# EAGLE design aurola-board (EAGLE 9.1.1)
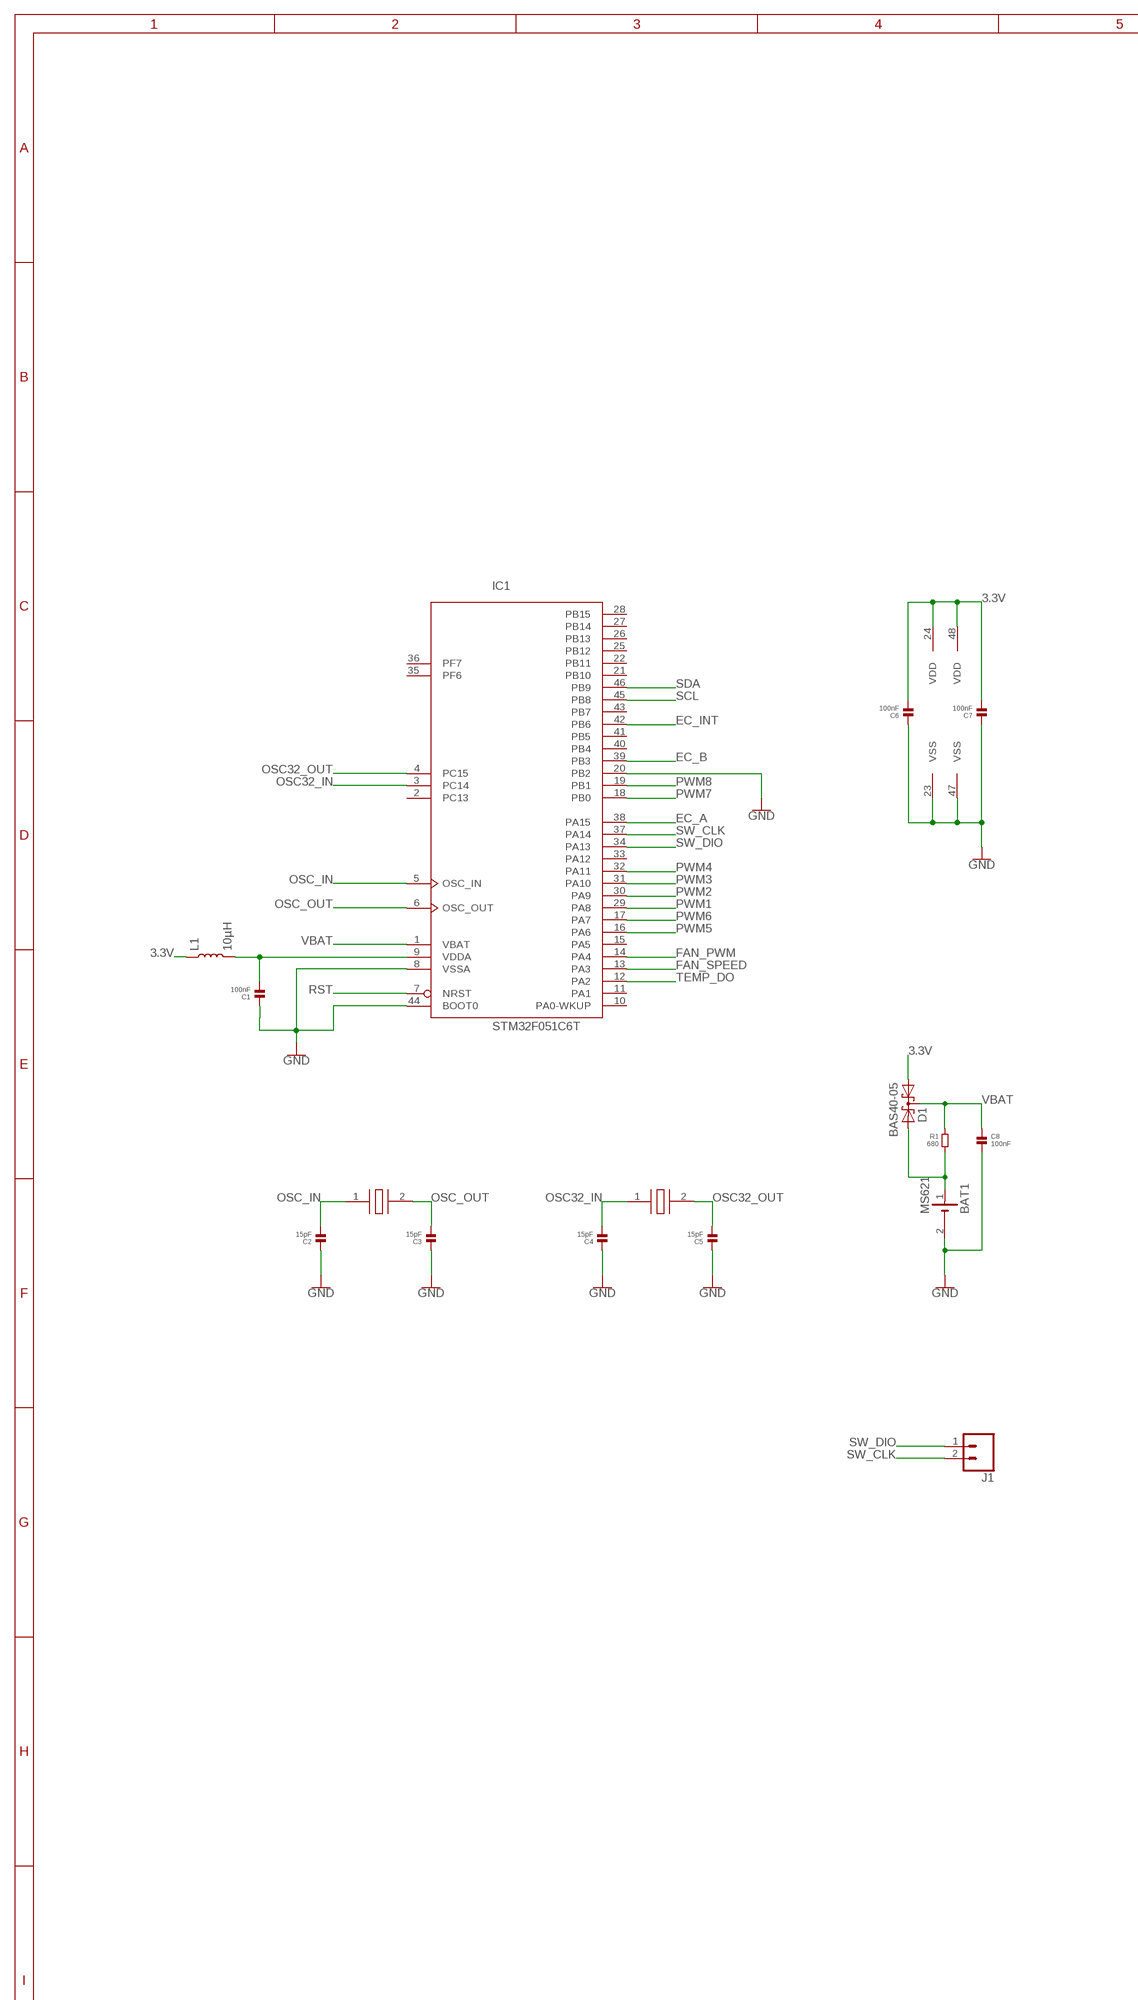
[diagram p0: schematic, sheet 1, part 1 of 2]
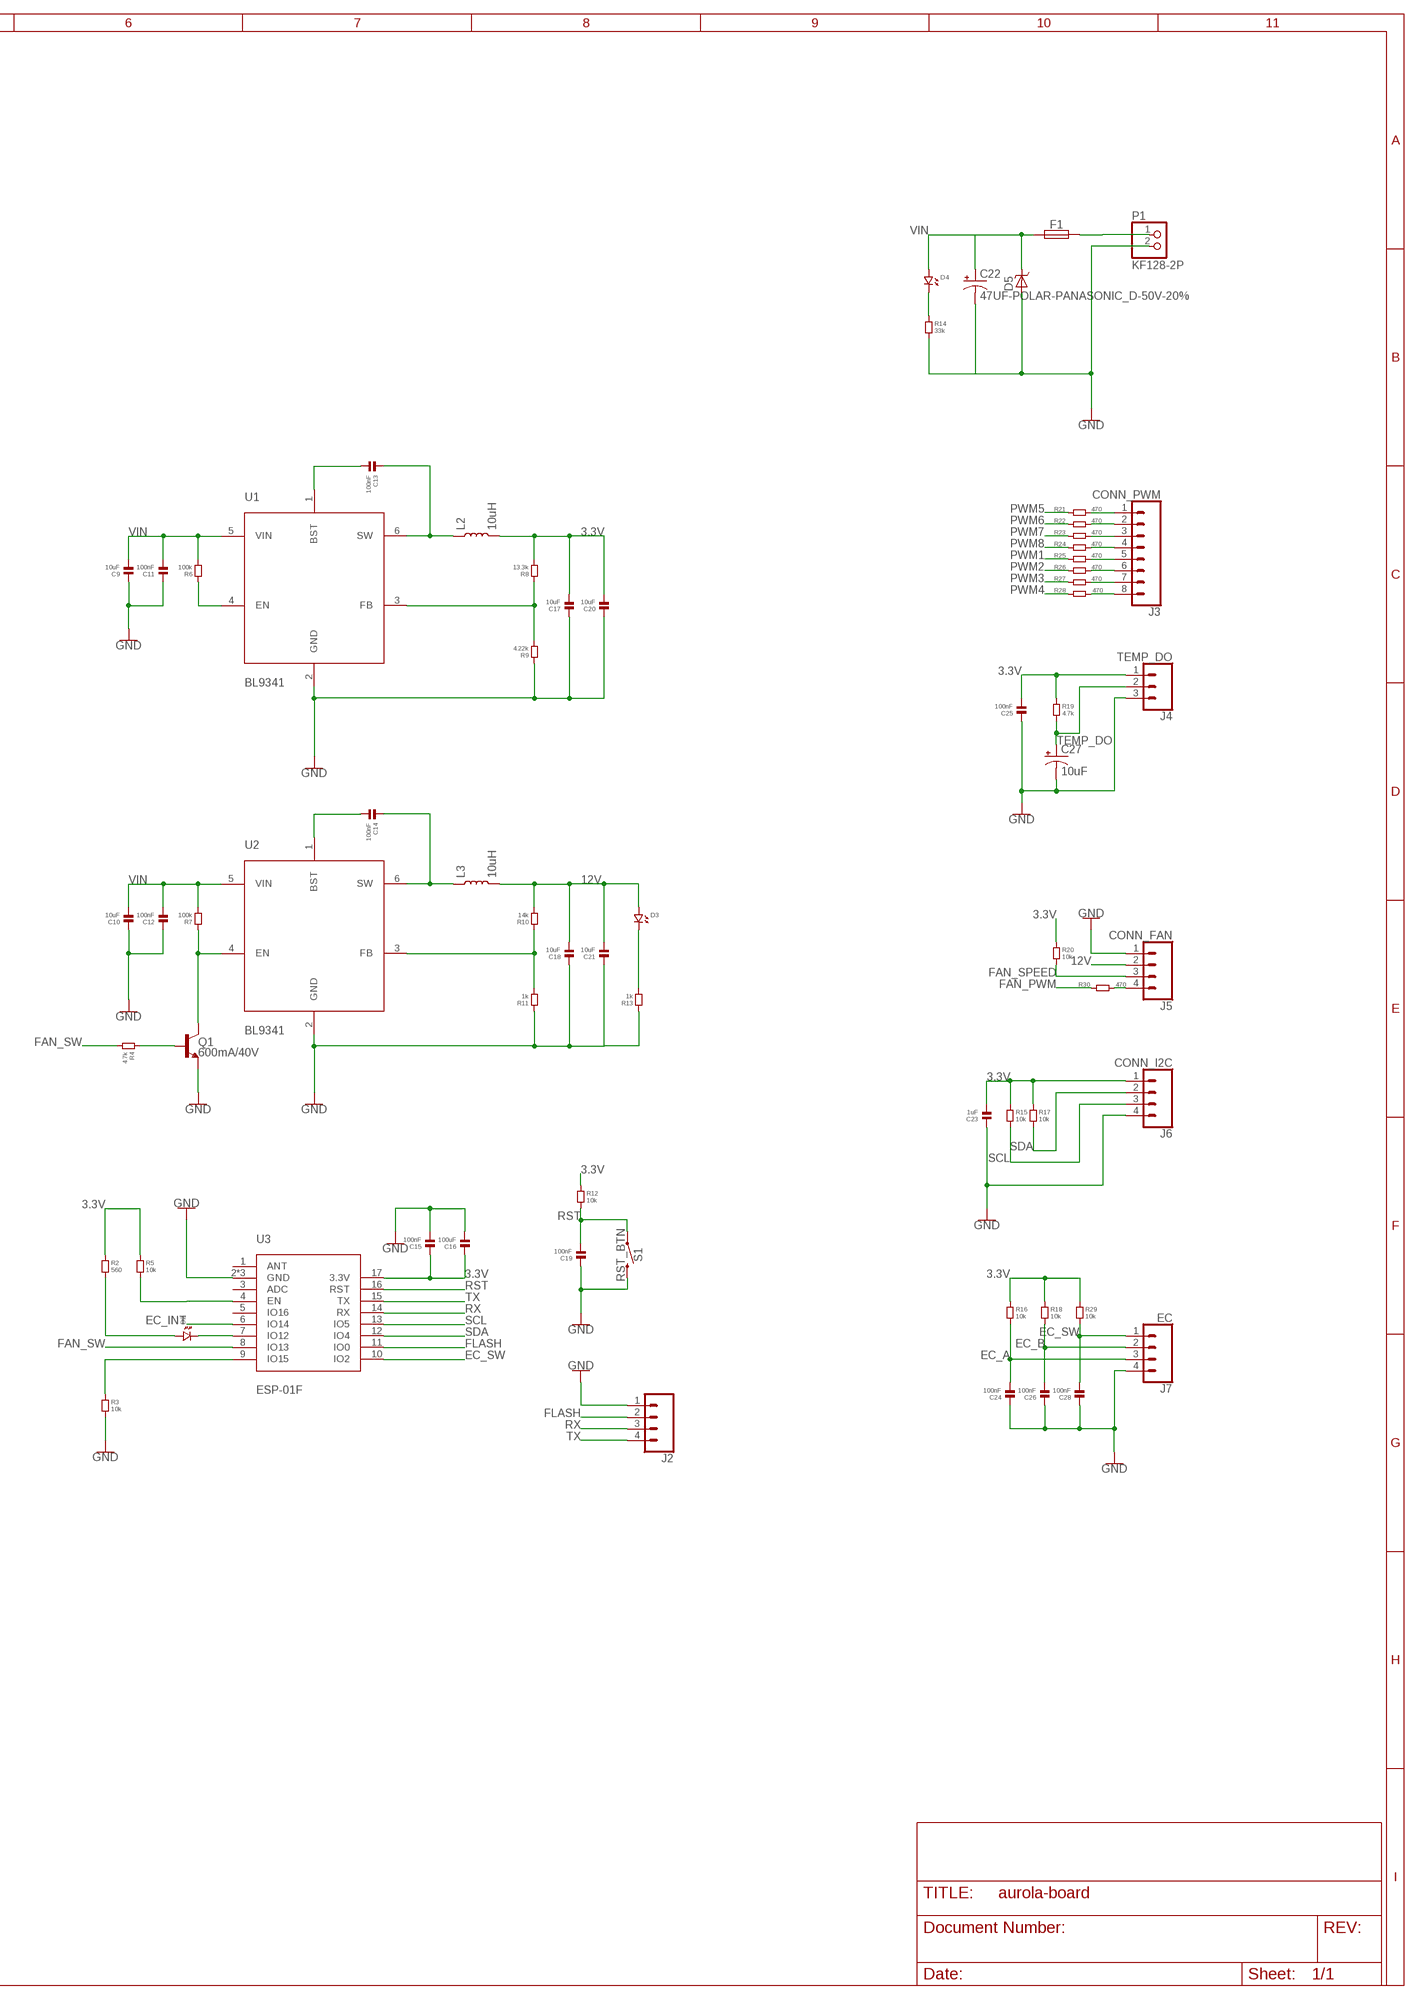
[diagram p1: schematic, sheet 1, part 2 of 2]

## Parts
BAT1  MS621  [SMT_BAT]
C1  100nF  CAPACITOR.0603  [0603]
C2  15pF  CAPACITOR.0603  [0603]
C3  15pF  CAPACITOR.0603  [0603]
C4  15pF  CAPACITOR.0603  [0603]
C5  15pF  CAPACITOR.0603  [0603]
C6  100nF  CAPACITOR.0603  [0603]
C7  100nF  CAPACITOR.0603  [0603]
C8  100nF  CAPACITOR.0603  [0603]
C9  10uF  CAPACITOR.1206  [1206]
C10  10uF  CAPACITOR.1206  [1206]
C11  100nF  CAPACITOR.0805  [0805]
C12  100nF  CAPACITOR.0805  [0805]
C13  100nF  CAPACITOR.0603  [0603]
C14  100nF  CAPACITOR.0603  [0603]
C15  100nF  CAPACITOR.0603  [0603]
C16  100uF  CAPACITOR.1210  [1210]
C17  10uF  CAPACITOR.1206  [1206]
C18  10uF  CAPACITOR.1206  [1206]
C19  100nF  CAPACITOR.0603  [0603]
C20  10uF  CAPACITOR.1206  [1206]
C21  10uF  CAPACITOR.1206  [1206]
C22  47UF-POLAR-PANASONIC_D-50V-20%  [PANASONIC_D]
C23  1uF  CAPACITOR.0603  [0603]
C24  100nF  CAPACITOR.0603  [0603]
C25  100nF  CAPACITOR.0603  [0603]
C26  100nF  CAPACITOR.0603  [0603]
C27  10uF  10UF-POLAR-EIA3216-16V-10%(TANT)  [EIA3216]
C28  100nF  CAPACITOR.0603  [0603]
D1  BAS40-05  [SOT23]
D2  LED.0603  [0603.LED]
D3  LED.0603  [0603.LED]
D4  LED.0603  [0603.LED]
D5  D_TVS-SMA  [SMA_DO214AC]
F1  FUSE-1206  [C1206]
IC1  STM32F051C6T  [LQFP48]
J1  CONN_02  [1X02]
J2  CONN_04  [1X04]
J3  CONN_PWM  PH2.0_8P_SMD  [PH2.0_8P]
J4  TEMP_DO  PH2.0_3P_SMD  [PH2.0_3P]
J5  CONN_FAN  PH2.0_4P_SMD  [PH2.0_4P]
J6  CONN_I2C  PH2.0_4P_SMD  [PH2.0_4P]
J7  EC  PH2.0_4P_SMD  [PH2.0_4P]
L1  10µH  INDUCTOR-0805-3.3UH  [0805]
L2  10uH  INDUCTOR-CR54-47UH  [CR54]
L3  10uH  INDUCTOR-CR54-47UH  [CR54]
P1  KF128-2P  [2P-2.54MM]
Q1  600mA/40V  TRANS_NPN-MMBT2222AL  [SOT23-3]
R1  680  RESISTOR.0805  [0805]
R2  560  RESISTOR.0603  [0603]
R3  10k  RESISTOR.0603  [0603]
R4  4.7k  RESISTOR.0603  [0603]
R5  10k  RESISTOR.0603  [0603]
R6  100k  RESISTOR.0603  [0603]
R7  100k  RESISTOR.0603  [0603]
R8  13.3k  RESISTOR.0603  [0603]
R9  4.22k  RESISTOR.0603  [0603]
R10  14k  RESISTOR.0603  [0603]
R11  1k  RESISTOR.0603  [0603]
R12  10k  RESISTOR.0603  [0603]
R13  1k  RESISTOR.0603  [0603]
R14  33k  RESISTOR.0603  [0603]
R15  10k  RESISTOR.0603  [0603]
R16  10k  RESISTOR.0603  [0603]
R17  10k  RESISTOR.0603  [0603]
R18  10k  RESISTOR.0603  [0603]
R19  4.7k  RESISTOR.0603  [0603]
R20  10k  RESISTOR.0603  [0603]
R21  470  RESISTOR.0603  [0603]
R22  470  RESISTOR.0603  [0603]
R23  470  RESISTOR.0603  [0603]
R24  470  RESISTOR.0603  [0603]
R25  470  RESISTOR.0603  [0603]
R26  470  RESISTOR.0603  [0603]
R27  470  RESISTOR.0603  [0603]
R28  470  RESISTOR.0603  [0603]
R29  10k  RESISTOR.0603  [0603]
R30  470  RESISTOR.0603  [0603]
S1  RST_BTN  MOMENTARY-SWITCH-SPST-SMD-6.0X3.5MM  [TACTILE_SWITCH_SMD_6.0X3.5MM]
U1  BL9341  [SOT23-6]
U2  BL9341  [SOT23-6]
U3  ESP-01F  [ESP-01F]
Y1  NX5032CA-8MHZ  [NX5032CA-8MHZ]
Y2  32.768KHZ-FC-135  [32.768KHZ-FC-135]

## Nets
3.3V: C6.2 C7.2 C15.1 C16.1 C17.2 C20.2 C23.2 C25.2 D1.1(A1) IC1.24(VDD) IC1.48(VDD) J4.1 J6.1 L1.1 L2.P$2 R2.1 R5.1 R8.2 R12.1 R15.1 R16.1 R17.1 R18.1 R19.1 R20.1 R29.1 U3.17(3.3V)
12V: C18.2 C21.2 D3.P$1 J5.2 L3.P$2 R10.2
EC_A: C24.2 IC1.38(PA15) J7.3 R16.2
EC_B: C26.2 IC1.39(PB3) J7.2 R18.2
EC_INT: IC1.42(PB6) U3.6(IO14)
EC_SW: C28.2 J7.1 R29.2 U3.10(IO2)
FAN_PWM: IC1.14(PA4) R30.1
FAN_SPEED: IC1.13(PA3) J5.3 R20.2
FAN_SW: R4.2 U3.8(IO13)
FLASH: J2.2 U3.11(IO0)
GND: BAT1.2(-) C1.1 C2.1 C3.1 C4.1 C5.1 C6.1 C7.1 C8.2 C9.1 C10.1 C11.1 C12.1 C15.2 C16.2 C17.1 C18.1 C19.1 C20.1 C21.1 C22.- C23.1 C24.1 C25.1 C26.1 C27.- C28.1 D5.A IC1.8(VSSA) IC1.20(PB2) IC1.23(VSS) IC1.44(BOOT0) IC1.47(VSS) J2.1 J4.3 J5.1 J6.4 J7.4 P1.2 Q1.2(E) R3.2 R9.1 R11.1 R13.1 R14.2 S1.2 U1.2(GND) U2.2(GND) U3.2(GND) U3.18(GND) U3.19(GND)
N$1: Q1.3(C) R7.1 U2.4(EN)
N$2: C13.1 L2.P$1 U1.6(SW)
N$3: R6.1 U1.4(EN)
N$4: R8.1 R9.2 U1.3(FB)
N$5: R10.1 R11.2 U2.3(FB)
N$6: C14.1 L3.P$1 U2.6(SW)
N$7: C14.2 U2.1(BST)
N$8: C13.2 U1.1(BST)
N$9: J3.1 R21.2
N$10: J3.2 R22.2
N$11: J3.3 R23.2
N$12: J3.4 R24.2
N$13: J3.5 R25.2
N$14: J3.6 R26.2
N$15: J3.7 R27.2
N$16: J3.8 R28.2
N$17: R5.2 U3.4(EN)
N$18: J5.4 R30.2
N$19: R3.1 U3.9(IO15)
N$20: Q1.1(B) R4.1
N$21: BAT1.1(+) D1.2(A2) R1.2
N$22: C1.2 IC1.9(VDDA) L1.2
N$23: D2.P$2 U3.7(IO12)
N$24: D2.P$1 R2.2
N$25: F1.2 P1.1
N$27: D4.P$2 R14.1
N$28: D3.P$2 R13.2
OSC32_IN: C4.2 IC1.3(PC14) Y2.1(1.XIN)
OSC32_OUT: C5.2 IC1.4(PC15) Y2.2(2.XIN)
OSC_IN: C2.2 IC1.5(OSC_IN) Y1.1(1.XIN)
OSC_OUT: C3.2 IC1.6(OSC_OUT) Y1.2(2.XOUT)
PWM1: IC1.29(PA8) R25.1
PWM2: IC1.30(PA9) R26.1
PWM3: IC1.31(PA10) R27.1
PWM4: IC1.32(PA11) R28.1
PWM5: IC1.16(PA6) R21.1
PWM6: IC1.17(PA7) R22.1
PWM7: IC1.18(PB0) R23.1
PWM8: IC1.19(PB1) R24.1
RST: C19.2 IC1.7(NRST) R12.2 S1.1 U3.16(RST)
RX: J2.3 U3.14(RX)
SCL: IC1.45(PB8) J6.3 R15.2 U3.13(IO5)
SDA: IC1.46(PB9) J6.2 R17.2 U3.12(IO4)
SW_CLK: IC1.37(PA14) J1.2
SW_DIO: IC1.34(PA13) J1.1
TEMP_DO: C27.+ IC1.12(PA2) J4.2 R19.2
TX: J2.4 U3.15(TX)
VBAT: C8.1 D1.3(K1K2) IC1.1(VBAT) R1.1
VIN: C9.2 C10.2 C11.2 C12.2 C22.+ D4.P$1 D5.C F1.1 R6.2 R7.2 U1.5(VIN) U2.5(VIN)
Unconnected: IC1.2(PC13) IC1.10(PA0-WKUP) IC1.11(PA1) IC1.15(PA5) IC1.21(PB10) IC1.22(PB11) IC1.25(PB12) IC1.26(PB13) IC1.27(PB14) IC1.28(PB15) IC1.33(PA12) IC1.35(PF6) IC1.36(PF7) IC1.40(PB4) IC1.41(PB5) IC1.43(PB7) U3.1(ANT) U3.3(ADC) U3.5(IO16)

## Library data of the parts
BAT1 = chip:MS621
C1-C21 C23-C26 C28 = standardparts:CAPACITOR
C22 = SparkFun-Capacitors:47UF-POLAR: 47µF polarized capacitors A capacitor is a passive two-terminal electrical component used to store electrical energy temporarily in an electric field.
C27 = SparkFun-Capacitors:10UF-POLAR: 10.0µF polarized capacitors A capacitor is a passive two-terminal electrical component used to store electrical energy temporarily in an electric field.; PROD_ID: CAP-00811
D1 = nxp_60:BAS40-05: General-purpose Schottky diodes General-purpose Schottky diodes in small Surface-Mounted Device (SMD) plastic packages AAL Eindhoven MK
D2-D4 = standardparts:LED
D5 = we-rcl:D_TVS: TVS Diodes (Transient Voltage Suppressor Diodes)
F1 = we-rcl:FUSE: Fuses Polyfuses 0805 - 0.5A or 1A, 6V 1206 - 2A, 6V 1812 - 1A or 2A, 16V
IC1 = micro-stm_v2:STM32F051C*T: ARM 32-bit Cortex™-M0 CPU 48 MHz maximum frequency 16 to 64 Kbytes of Flash memory 4 to 8 kbytes of SRAM 39 GPIOs 2.0 to 3.6 V application supply
J1 = SparkFun-Connectors:CONN_02: Multi connection point. Often used as Generic Header-pin footprint for 0.1 inch spaced/style header connections On any of the 0.1 inch spaced packages, you can populate with these: Break Away Headers - Straight <https://www.sparkfun.com/products/116> (PRT-00116) Break Away Male Headers - Right Angle <https://www.sparkfun.com/products/553> (PRT-00553) Female Headers <https://www.sparkfun.com/products/115> (PRT-00115) Break Away Headers - Machine Pin <https://www.sparkfun.com/products/117> (PRT-00117) Break Away Female Headers - Swiss Machine Pin <https://www.sparkfun.com/products/743> (PRT-00743) For SCREWTERMINALS and SPRING TERMINALS visit here: Screw Terimnals on SparkFun.com <https://www.sparkfun.com/search/results?term=Screw+Terminals> (5mm/3.5mm/2.54mm spacing) This device is also useful as a general connection point to wire up your design to another part of your project. Our various solder wires solder well into these plated through hole pads. Hook-Up Wire - Assortment (Stranded, 22 AWG) <https://www.sparkfun.com/products/11375> (PRT-11375) Hook-Up Wire - Assortment (Solid Core, 22 AWG) <https://www.sparkfun.com/products/11367> (PRT-11367) View the entire wire category on our website here <https://www.sparkfun.com/categories/141> Special notes: Molex polarized connector foot print use with: PRT-08233 with associated crimp pins and housings. 2.54_SCREWTERM for use with PRT-10571. 3.5mm Screw Terminal footprints for PRT-08084 5mm Screw Terminal footprints for use with PRT-08432
J2 = SparkFun-Connectors:CONN_04: Multi connection point. Often used as Generic Header-pin footprint for 0.1 inch spaced/style header connections On any of the 0.1 inch spaced packages, you can populate with these: Break Away Headers - Straight <https://www.sparkfun.com/products/116> (PRT-00116) Break Away Male Headers - Right Angle <https://www.sparkfun.com/products/553> (PRT-00553) Female Headers <https://www.sparkfun.com/products/115> (PRT-00115) Break Away Headers - Machine Pin <https://www.sparkfun.com/products/117> (PRT-00117) Break Away Female Headers - Swiss Machine Pin <https://www.sparkfun.com/products/743> (PRT-00743) For SCREWTERMINALS and SPRING TERMINALS visit here: Screw Terimnals on SparkFun.com <https://www.sparkfun.com/search/results?term=Screw+Terminals> (5mm/3.5mm/2.54mm spacing) This device is also useful as a general connection point to wire up your design to another part of your project. Our various solder wires solder well into these plated through hole pads. Hook-Up Wire - Assortment (Stranded, 22 AWG) <https://www.sparkfun.com/products/11375> (PRT-11375) Hook-Up Wire - Assortment (Solid Core, 22 AWG) <https://www.sparkfun.com/products/11367> (PRT-11367) View the entire wire category on our website here <https://www.sparkfun.com/categories/141> Special notes: Molex polarized connector foot print use with SKU : PRT-08231 with associated crimp pins and housings. 1MM SMD Version SKU: PRT-10208; PROD_ID: CONN-09696
J3 = conn_smt:PH2.0_8P_SMD: PH2.0_8P_SMD
J4 = conn_smt:PH2.0_3P_SMD: PH2.0_3P
J5-J7 = conn_smt:PH2.0_4P_SMD: PH2.0_4P_SMD
L1 = SparkFun-Coils:INDUCTOR: Inductors Resist changes in electrical current. Basically a coil of wire. SparkFun Products: SparkFun Load Cell Amplifier - HX711 <https://www.sparkfun.com/products/13879> IOIO-OTG - V2.2 <https://www.sparkfun.com/products/13613>; PROD_ID: NDUC-13076; VALUE: 3.3µH/±20%/450mA
L2 L3 = SparkFun-Coils:INDUCTOR: Inductors Resist changes in electrical current. Basically a coil of wire. SparkFun Products: SparkFun Load Cell Amplifier - HX711 <https://www.sparkfun.com/products/13879> IOIO-OTG - V2.2 <https://www.sparkfun.com/products/13613>; PROD_ID: NDUC-10789; VALUE: 47µH/±30%/750mA
P1 = chip:KF128-2P
Q1 = SparkFun-DiscreteSemi:TRANS_NPN: NPN transistor Current controlled devices typically used to amplify current or used as a switch. BC547 - COM-08928 <http://www.sparkfun.com/products/8928> (TO-92 45V 100mA) (1.Collector 2.Base 3.Emitter) 2N3904 - COM-00521 <http://www.sparkfun.com/products/521> (TO-92 40V 200mA) (1.Emitter 2.Base 3.Collector) P2N2222A - COM-12852 <http://www.sparkfun.com/products/12852> (TO-92 40V 600mA) (1.Collector 2.Base 3.Emitter); PROD_ID: TRANS-08049
R1-R30 = standardparts:RESISTOR
S1 = SparkFun-Switches:MOMENTARY-SWITCH-SPST: Momentary Switch (Pushbutton) - SPST Normally-open (NO) SPST momentary switches (buttons, pushbuttons). Variants PTH-12MM - 12mm square, through-hole Momentary Pushbutton Switch - 12mm Square <https://www.sparkfun.com/products/9190> (COM-09190) PTH-6.0MM, PTH-6.0MM-KIT - 6.0mm square, through-hole Mini Pushbutton Switch <https://www.sparkfun.com/products/97> (COM-00097) KIT package intended for soldering kit's - only one side of pads' copper is exposed. PTH-RIGHT-ANGLE-KIT - Right-angle, through-hole Right Angle Tactile Button <https://www.sparkfun.com/products/10791> - Used on SparkFun BigTime Watch Kit <https://www.sparkfun.com/products/11734> SMD-12MM - 12mm square, surface-mount Tactile Button - SMD (12mm) <https://www.sparkfun.com/products/12993> (COM-12993) Used on SparkFun PicoBoard <https://www.sparkfun.com/products/11888> SMD-4.5MM - 4.5mm Square Trackball Switch Used on SparkFun Blackberry Trackballer Breakout <https://www.sparkfun.com/products/13169> SMD-4.6MMX2.8MM - 4.60mm x 2.80mm, surface mount Used on SparkFun SAMD21 Mini Breakout <https://www.sparkfun.com/products/13664> SMD-5.2MM, SMD-5.2-REDUNDANT - 5.2mm square, surface-mount Mini Pushbutton Switch - SMD <https://www.sparkfun.com/products/8720> (COM-08720) Used on Arduino Pro Mini <https://www.sparkfun.com/products/11114> REDUNDANT package connects both switch circuits together SMD-6.0X3.5MM - 6.0 x 3.5mm, surface mount Momentary Reset Switch SMD <https://www.sparkfun.com/products/8229> (COM-08229) SMD-6.2MM-TALL - 6.2mm square, surface mount Tactile Button - SMD (6mm) <https://www.sparkfun.com/products/12992> Used on SparkFun Digital Sandbox <https://www.sparkfun.com/products/12651> SMD-RIGHT-ANGLE - Right-angle, surface mount Used on SparkFun Block for Intel® Edison - Arduino <https://www.sparkfun.com/products/13036>; PROD_ID: SWCH-00815; SF_SKU: COM-08229
U1 U2 = dcdc:BL9341: BL9341
U3 = esp_mod:ESP-01F: ESP-01F
Y1 = NX5032CA-8MHZ:NX5032CA-8MHZ
Y2 = 32.768KHZ-FC-135:32.768KHZ-FC-135

## Net classes
0 default: width 0.254 mm, drill 0.3 mm

## Board
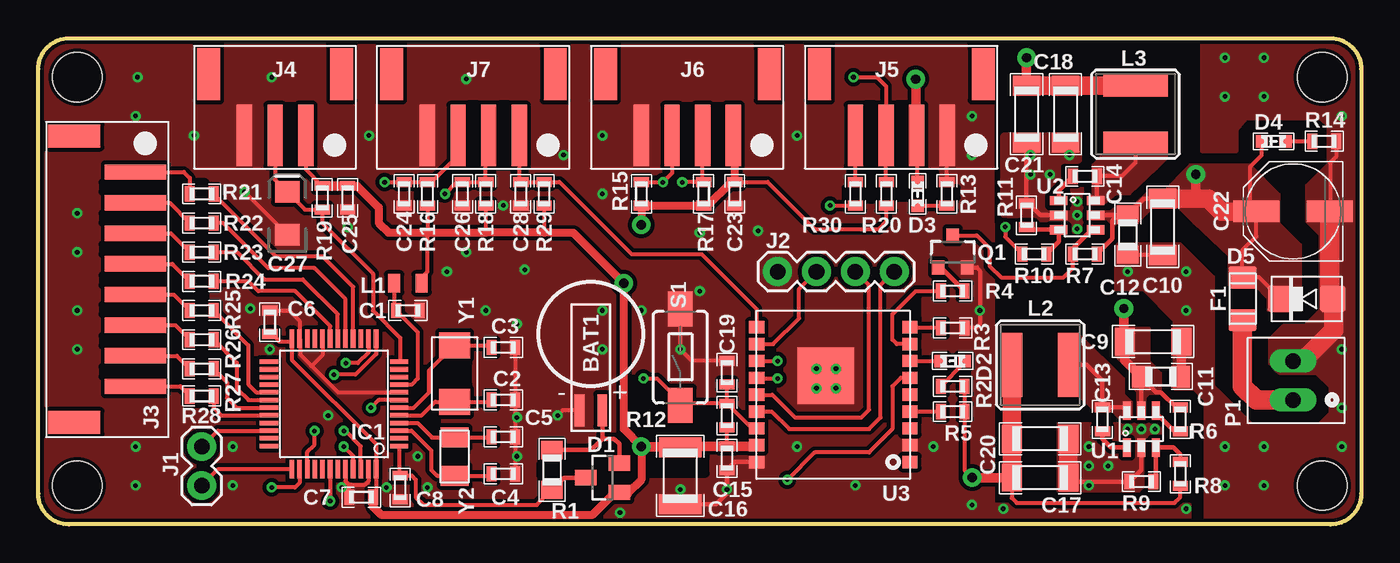
[diagram p2: board, top side]
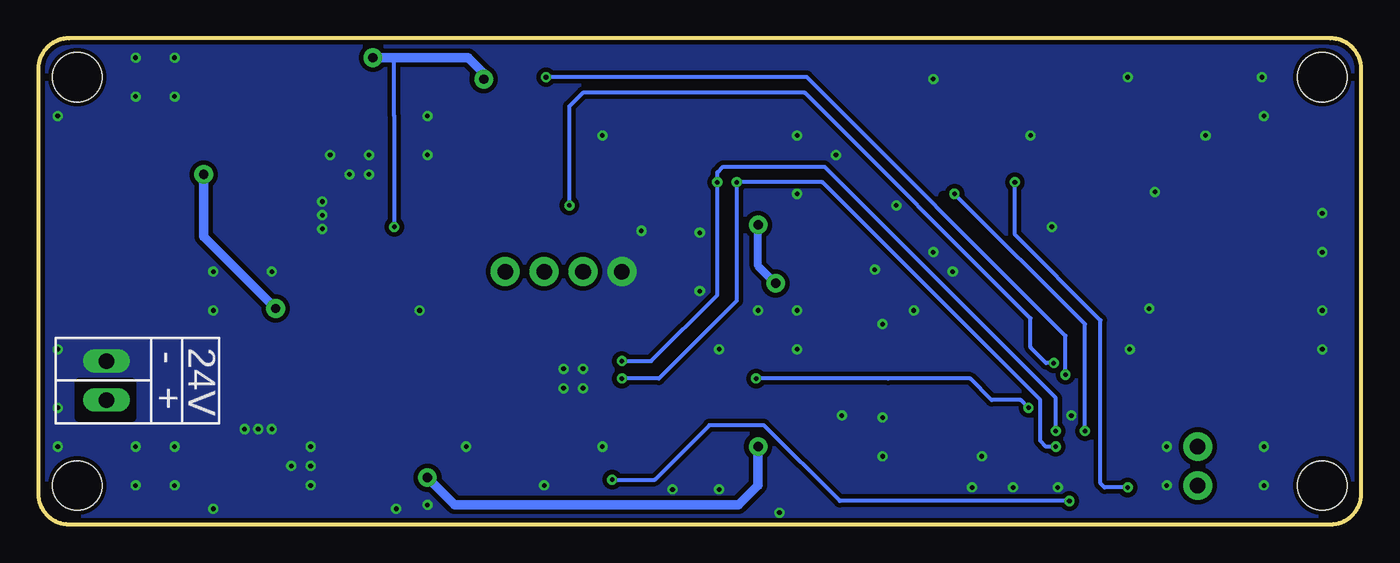
[diagram p3: board, bottom side, seen from below]

Size 86.36 x 31.75 mm. Coordinates in mm from the lower left corner, seen from the top.
Outline: 0,2 0,29.75 arc-90 2,31.75 84.36,31.75 arc-90 86.36,29.75 86.36,2 arc-90 84.36,0 2,0 arc-90 0,2
Copper layers (1*16): Top 0.035mm / dielectric 1.5mm / Bottom 0.035mm
Design rules "SparkFun-2-layer-TIGHT *": minimum track width 7mil, minimum drill 0.3mm, track to track 7mil, track to pad 7mil, pad to pad 7mil, via to via 7mil, smd to smd 0mil, copper to edge 7mil, drill to drill 7mil, minimum pad ring 7mil, minimum via ring 7mil, stop-mask expansion 4mil, vias tented up to drill 25mil, thermal gap 10mil
Holes 3.2 mm at 83.82,29.21 83.82,2.54 2.54,29.21 2.54,2.54
tRestrict: area 10.4,7.9 to 10.9,22.4; area 4.2,21.7 to 8.4,22.4; area 4.2,19.7 to 8.4,20.3; area 4.2,17.7 to 8.4,18.3; area 4.2,15.6 to 8.4,16.3; area 4.2,13.7 to 8.4,14.4; area 4.2,11.7 to 8.4,12.3; area 4.2,9.7 to 8.4,10.3; area 38.9,21.3 to 40.4,21.8; area 40,3.3 to 43.6,4.3; area 16.1,26 to 16.8,27.3; area 28.1,26.2 to 28.7,27.4; 18 more areas
bRestrict: area 26.9,21 to 27.3,21.5; area 80.4,9 to 83.7,9.3; area 80.4,7 to 83.7,7.2; area 83.6,7.4 to 83.7,8.9; area 80.3,7 to 80.4,9.3

### Footprints (pad centres in the part's own frame; a part is rotated, then mirrored left to right if it is on the bottom)
SMT_BAT = smd 2.1 x 0.65: 1 5,0.75; 2 5,-0.75
0603 = smd 0.65 x 1: 1 -0.775,0; 2 0.775,0
1206 = smd 1.3 x 1.8: 1 -1.85,0; 2 1.85,0
0805 = smd 1.2 x 1.4: 1 -1.3,0; 2 1.3,0
1210 = smd 1.3 x 2.8: 1 -1.85,0; 2 1.85,0
PANASONIC_D = smd 3 x 1.4: + 2.4,0; - -2.4,0
EIA3216 = smd 1.4 x 1.6: + 1.4,0; - -1.4,0
SOT23 = smd 1 x 1.4: 1 -0.95,-1.1; 2 0.95,-1.1; 3 0,1.1
0603.LED = smd 0.8 x 0.8: P$1 -0.775,0; P$2 0.775,0
SMA_DO214AC = smd 1.7 x 1.7: A 0,-1.7; C 0,1.7
C1206 = smd 1.8 x 1.45: 1 0,1.4; 2 0,-1.4
LQFP48 = smd 0.3 x 1.2: 1 -2.75,-4.25; 2 -2.25,-4.25; 3 -1.75,-4.25; 4 -1.25,-4.25; 5 -0.75,-4.25; 6 -0.25,-4.25; 7 0.25,-4.25; 8 0.75,-4.25; 9 1.25,-4.25; 10 1.75,-4.25; 11 2.25,-4.25; 12 2.75,-4.25; 25 2.75,4.25; 26 2.25,4.25; 27 1.75,4.25; 28 1.25,4.25; 29 0.75,4.25; 30 0.25,4.25; 31 -0.25,4.25; 32 -0.75,4.25; 33 -1.25,4.25; 34 -1.75,4.25; 35 -2.25,4.25; 36 -2.75,4.25 | smd 1.2 x 0.3: 13 4.25,-2.75; 14 4.25,-2.25; 15 4.25,-1.75; 16 4.25,-1.25; 17 4.25,-0.75; 18 4.25,-0.25; 19 4.25,0.25; 20 4.25,0.75; 21 4.25,1.25; 22 4.25,1.75; 23 4.25,2.25; 24 4.25,2.75; 37 -4.25,2.75; 38 -4.25,2.25; 39 -4.25,1.75; 40 -4.25,1.25; 41 -4.25,0.75; 42 -4.25,0.25; 43 -4.25,-0.25; 44 -4.25,-0.75; 45 -4.25,-1.25; 46 -4.25,-1.75; 47 -4.25,-2.25; 48 -4.25,-2.75
1X02 = drill 1.016 pad 1.88: 1 0,0; 2 2.54,0
1X04 = drill 1.016 pad 1.88: 1 0,0; 2 2.54,0; 3 5.08,0; 4 7.62,0
PH2.0_8P = smd 1 x 4: 1 14,0; 2 12,0; 3 10,0; 4 8,0; 5 6,0; 6 4,0; 7 2,0; 8 0,0 | smd 1.5 x 3.4: TL -2.35,4; TR 16.35,4
PH2.0_3P = smd 1 x 4: 1 4,0; 2 2,0; 3 0,0 | smd 1.5 x 3.4: TL -2.35,4; TR 6.35,4
PH2.0_4P = smd 1 x 4: 1 6,0; 2 4,0; 3 2,0; 4 0,0 | smd 1.5 x 3.4: TL -2.35,4; TR 8.35,4
0805' = smd 0.8 x 1.2: 1 -0.9,0; 2 0.9,0
CR54 = smd 4.2 x 1.4: P$1 0,1.85; P$2 0,-1.85
2P-2.54MM = drill 1.016 long: 1 1.27,0; 2 -1.27,0
SOT23-3 = smd 0.8 x 0.9: 1 -0.95,-1; 2 0.95,-1; 3 0,1.1
TACTILE_SWITCH_SMD_6.0X3.5MM = smd 2.3 x 1.6: 1 -3.15,0; 2 3.15,0
SOT23-6 = smd 1.2 x 0.6: 1 -1.2,0.95; 2 -1.2,0; 3 -1.2,-0.95; 4 1.2,-0.95; 5 1.2,0; 6 1.2,0.95
ESP-01F = smd 1 x 0.8: 1 0,9.9; 2 0,8.8; 3 0,7.7; 4 0,6.6; 5 0,5.5; 6 0,4.4; 7 0,3.3; 8 0,2.2; 9 0,1.1; 10 10,1.1; 11 10,2.2; 12 10,3.3; 13 10,4.4; 14 10,5.5; 15 10,6.6; 16 10,7.7; 17 10,8.8; 18 10,9.9 | smd 3.7 x 3.7: 19 5.5,4.25
NX5032CA-8MHZ = smd 1.7 x 2: 1 0,0; 2 3.7,0
32.768KHZ-FC-135 = smd 1.3 x 1.8: 1 0,0; 2 2.5,0

### Placement (x,y rotation side)
BAT1  36.07,12.45 270 top
C1  24.13,13.97 180 top
C2  30.35,8.13 180 top
C3  30.35,11.56 180 top
C4  30.35,3.3 180 top
C5  30.35,5.71 180 top
C6  15.11,13.21 270 top
C7  21.08,1.78 0 top
C8  23.62,2.41 270 top
C9  72.77,11.94 180 top
C10  73.41,19.43 90 top
C11  73.28,9.65 180 top
C12  71.12,18.92 90 top
C13  69.47,6.86 270 top
C14  68.33,22.73 180 top
C15  44.96,4.32 270 top
C16  41.91,3.17 270 top
C17  65.41,3.05 180 top
C18  67.06,26.8 90 top
C19  44.96,9.91 270 top
C20  65.41,5.59 180 top
C21  64.52,26.8 90 top
C22  81.92,20.45 180 top
C23  45.47,21.59 90 top
C24  23.88,21.59 90 top
C25  20.19,21.34 90 top
C26  27.69,21.59 90 top
C27  16.26,20.32 90 top
C28  31.5,21.59 90 top
D1  36.83,3.05 90 top
D2  59.69,10.67 180 top
D3  57.4,21.59 270 top
D4  80.64,25.02 0 top
D5  82.8,14.73 90 top
F1  78.61,14.73 0 top
IC1  19.3,7.87 90 top
J1  10.67,5.08 270 top
J2  48.26,16.51 0 top
J3  6.35,9.01 90 top
J4  13.46,25.4 0 top
J5  53.34,25.4 0 top
J6  39.37,25.4 0 top
J7  25.4,25.4 0 top
L1  10µH  [0805']  24.13,15.75 180 top
L2  65.41,10.41 270 top
L3  71.63,26.8 180 top
P1  81.92,9.4 270 top
Q1  59.69,17.78 0 top
R1  33.53,3.56 90 top
R2  59.69,9.02 180 top
R3  59.69,12.83 0 top
R4  59.69,15.24 180 top
R5  59.69,7.37 180 top
R6  74.55,6.86 90 top
R7  68.33,17.65 0 top
R8  74.55,3.3 270 top
R9  72.01,2.79 0 top
R10  65.02,17.65 180 top
R11  64.52,20.19 270 top
R12  44.96,7.11 90 top
R13  59.31,21.59 270 top
R14  83.95,25.02 0 top
R15  39.37,21.59 90 top
R16  25.4,21.59 90 top
R17  43.43,21.59 90 top
R18  29.21,21.59 90 top
R19  18.54,21.34 270 top
R20  55.37,21.59 90 top
R21  10.67,21.59 180 top
R22  10.67,19.68 180 top
R23  10.67,17.78 180 top
R24  10.67,15.88 180 top
R25  10.67,13.97 180 top
R26  10.67,12.06 180 top
R27  10.67,10.16 180 top
R28  10.67,8.38 180 top
R29  33.02,21.59 90 top
R30  53.34,21.59 90 top
S1  41.91,10.92 90 top
U1  72.01,6.22 90 top
U2  67.82,20.19 0 top
U3  56.9,13.97 180 top
Y1  27.18,8 90 top
Y2  27.18,3.17 90 top

### Tracks (layer width: path | path; a pad name or v marks a point on that pad's centre or on a via)
3.3V  (via drill 0.61 pad 1.22)
  Top 0.254: C17.2 63.55,1.72 63.88,1.4 74.17,1.4 74.55,1.78 R8.2 | C15.1 R12.1 | R2.1 R5.1 60.47,3.54 v60.96,3.05 | 41.85,5.08 C16.1 | C7.2 22.05,1.98 IC1.48 22.05,5.25 16.55,10.75 16.55,11.94 | IC1.24 16.55,11.94 | C6.2 15.25,12.43 15.75,11.94 16.55,11.94 | 45.24,22.36 C23.2 47.61,22.36 50.67,19.3 54.86,19.3 55.37,19.81 R20.1 | 45.47,25.3 J6.1 | R17.1 43.69,20.82 | R16.1 25.4,19.05 25.4,16.51 25.03,16.14 L1.1 | R18.1 29.21,19.05 | 33.53,19.04 33.52,19.05 | R29.1 33.02,19.05 | J4.1 17.46,23.19 R19.1
  Top 0.457: 37.66,2.1 D1.1
  Top 0.508: 38.48,2.03 39.37,2.92 v39.37,5.08 38.23,6.22 v38.23,15.75 34.94,19.04 33.53,19.04 | 37.66,2.1 36.2,0.64 22.36,0.64 21.86,1.14 C7.2 | 43.69,20.82 45.24,22.36 | C23.2 45.47,25.3 | C25.2 20.82,22.11 22.23,20.7 22.23,19.68 22.86,19.05 25.4,19.05 29.21,19.05 33.02,19.05 33.52,19.05 | R17.1 R15.1 v39.37,19.56
  Top 0.61: C16.1 41.98,5.09 C15.1 46.82,5.09 U3.17 | v60.96,3.05 C17.2 | v39.37,5.08 41.85,5.08 | 38.48,2.03 38.41,2.1 D1.1 | R19.1 C25.2
  Top 1.219: L2.P$2 C20.2 C17.2
  Bottom 0.508: v38.23,15.75 39.37,16.89 v39.37,19.56
  Bottom 0.61: v60.96,3.05 59.18,1.27 40.64,1.27 39.37,2.54 v39.37,5.08
12V  (via drill 0.3, 0.61 pad 1.22)
  Top 0.254: J5.2 57.28,25.46 57.4,25.34 D3.P$1 | v63.12,19.43 63.12,18.78 R10.2
  Top 0.61: C21.2 v64.52,30.48 | v57.28,29.08 57.28,25.46
  Top 1.219: C21.2 C18.2 L3.P$2
  Bottom 0.254: v63.12,19.43 63.12,26.67 63.12,30.48
  Bottom 0.61: v64.52,30.48 63.12,30.48 58.29,30.48 57.28,29.46 v57.28,29.08
EC_A  (via drill 0.3)
  Top 0.254: J7.3 27.4,24.16 27.43,24.13 25.67,22.36 R16.2 C24.2 22.62,22.36 v22.61,22.35 | IC1.38 17.05,2.7 16.76,2.41 v15.24,2.41
  Bottom 0.254: v22.61,22.35 22.61,18.92 17.02,13.34 17.02,2.67 16.76,2.41 v15.24,2.41
EC_B  (via drill 0.3)
  Top 0.254: J7.2 29.21,25.21 R18.2 C26.2 27.32,22.36 v26.54,21.59 | IC1.39 17.55,4.73 18.03,5.21 v18.03,6.1
  Bottom 0.254: v18.03,6.1 18.03,13.08 v26.54,21.59
EC_INT  (via drill 0.3)
  Top 0.254: U3.6 56.31,9.57 55.75,9.02 55.75,6.22 54.23,4.7 50.67,4.7 v48.9,2.92 | IC1.42 v19.05,1.53 v19.05,1.52
  Bottom 0.254: v19.05,1.52 34.04,1.52 38.99,6.48 42.55,6.48 46.1,2.92 v48.9,2.92
EC_SW
  Top 0.254: J7.1 31.4,22.46 C28.2 R29.2 34.02,22.36 38.73,17.65 43.31,17.65 46.9,14.06 U3.10
FAN_PWM  (via drill 0.3)
  Top 0.254: v51.69,20.83 51.7,20.82 R30.1 | IC1.14 21.55,11.24 20.85,10.54 v20.07,10.54
  Bottom 0.254: v20.07,10.54 20.57,10.54 21.59,11.56 21.59,13.46 36.32,28.19 50.8,28.19 51.69,27.3 v51.69,20.83
FAN_SPEED  (via drill 0.3)
  Top 0.254: R20.2 55.34,22.4 J5.3 55.34,28.61 54.74,29.21 v53.21,29.21 | IC1.13 22.05,11.13 20.7,9.78 v19.3,9.78
  Bottom 0.254: v53.21,29.21 36.2,29.21 19.3,12.32 v19.3,9.78
FAN_SW
  Top 0.254: U3.8 56.05,11.77 55.75,12.06 55.75,13.72 57.28,15.24 R4.2
FLASH
  Top 0.254: U3.11 47.97,11.77 49.66,13.46 49.66,15.37 J2.2
GND  (via drill 0.3)
  Top 0.254: R11.1 64.63,20.97 | C12.1 73.36,17.62 C10.1 | R14.2 84.72,24.02 84.33,23.62 C22.- | 84.31,14.92 D5.A 84.58,14.65 | 74.62,9.69 C11.1 | C17.1 67.51,2.79 | R13.1 59.31,25.37 J5.1 | R3.2 61.21,12.83 61.47,13.08 v61.47,13.97 61.47,16.59 61.27,16.78 Q1.2 | C3.1 C2.1 C5.1 C4.1 | BAT1.2 34.24,7.45 v33.91,7.11 | v13.46,21.72 v13.46,21.71 C27.- | C6.1 16.37,13.98 17.05,13.3 IC1.23 17.1,12.08 17.1,11.09 17.84,10.35 | C19.1 42.66,10.68 v41.91,11.43 S1.2 | 17.84,10.35 19.56,8.62 IC1.8 | IC1.20 18.55,11.06 17.84,10.35 | IC1.47 21.55,2.82 21.33,2.59 20.43,2.59 20.41,2.59 | IC1.44 20.05,2.82 20.34,2.53 20.41,2.59 | C7.1 20.31,2.59 20.41,2.59
  Top 0.305: 64.63,20.97 65.41,20.19 U2.2 | R11.1 C21.1 | U1.2 72.01,3.57 R9.1 67.51,2.79 | C16.2 44.25,1.32 44.96,2.03 v44.96,2.29 C15.2 45.48,4.07 U3.18
  Top 0.61: C9.1 74.62,9.69
  Top 1.219: C20.1 C17.1
  Top 1.27: C22.- 84.31,14.92 | P1.2 82.55,10.67 84.58,12.7 84.58,14.65
  other vias: 67.82,21.08 67.82,20.19 67.82,19.3 71.12,6.22 72.01,6.22 72.9,6.22 13.84,14.1 15.11,11.43 20.19,19.43 50.8,10.16 52.07,10.16 52.07,8.89 50.8,8.89 36.83,13.97 39.37,13.97 36.83,11.43 43.18,15.24 30.35,20.83 27.94,17.78 26.67,16.51 31.75,16.64 31.24,13.08 36.83,21.59 36.83,25.4 34.29,24.13 24.77,4.45 25.4,2.41 22.73,2.41 12.7,5.08 12.7,2.54 19.81,2.41 71.12,16.51 74.93,16.51 74.93,13.97 77.47,27.94 77.47,30.48 80.01,30.48 80.01,27.94 85.09,26.67 85.09,11.43 85.09,7.62 85.09,5.08 80.01,5.08 80.01,2.54 77.47,5.08 77.47,2.54 43.18,19.05 58.42,5.08 6.48,29.21 2.54,20.32 2.54,11.43 6.35,26.67 6.35,5.08 6.35,2.54 2.54,17.78 2.54,13.97 15.24,29.21 27.94,29.08 21.59,25.4 10.16,25.4 49.53,25.4 46.99,19.18 64.77,24.13 67.31,24.13 64.77,22.86 66.04,22.86 68.58,5.08 68.58,2.54 68.58,3.81 69.85,3.81 60.96,1.27 74.93,1.02 62.99,1.02 41.91,2.29 60.96,26.67 60.96,24.13 31.24,4.45 31.24,6.99 29.21,13.97 49.53,5.08 53.34,2.54 37.97,0.76 18.92,7.11
  pour Top (isolate 0.254, no thermals): 63.37,25.53 63.12,25.53 arc90 62.87,25.27 62.87,20.32 arc90 63.12,20.07 64.64,20.07 64.9,20.07 65.15,20.07 65.41,19.81 66.8,19.81 67.56,19.05 67.94,19.05 68.2,19.3 68.2,21.59 68.2,21.72 68.2,21.97 67.69,21.97 67.44,21.97 67.44,20.45 65.91,20.45 65.66,20.7 65.66,20.95 65.66,21.59 66.67,22.61 66.67,23.37 arc-90 66.93,23.62 67.82,23.62 arc90 68.07,23.88 68.07,25.27 arc90 67.82,25.53
  pour Top (isolate 0.254, no thermals): 66.55,6.6 66.55,2.16 71.88,2.16 72.14,2.41 72.14,5.46 72.39,5.71 72.52,5.84 73.28,5.84 73.28,6.48 73.15,6.6 66.8,6.6
  pour Top (isolate 0.254, no thermals): 70.36,18.29 70.36,15.37 70.87,15.37 72.14,15.37 74.17,13.34 74.17,8.89 75.44,8.89 76.2,8.13 76.2,0.38 86.11,0.13 86.11,31.88 75.95,31.88 75.95,24.38 78.23,24.38 78.23,25.78 78.87,26.54 79.88,26.54 83.69,26.54 84.2,26.04 84.2,23.5 82.8,22.1 82.8,19.81 83.69,18.92 83.69,13.97 82.68,12.95 81.28,12.95 80.39,12.06 80.39,11.81 80.39,10.54 81.03,9.91 83.44,9.91 84.33,9.02 84.33,7.24 83.57,6.48 79.25,6.48 77.22,8.51 76.71,9.02 76.71,16.13 74.55,18.29
  pour Bottom (isolate 0.305, no thermals): -1.27,34.29 -1.27,-2.54 88.9,-2.54 88.9,34.29
  pour Top (isolate 0.254, no thermals): -4.32,37.85 -4.32,-4.32 75.18,-4.32 75.18,1.27 62.34,1.28 62.31,38.1
  pour Top (isolate 0.254, no thermals): 70.36,18.29 70.36,15.37 70.87,15.37 72.14,15.37 74.17,13.34 74.17,8.89 75.44,8.89 76.2,8.13 76.2,0.38 86.11,0.13 86.11,31.88 75.95,31.88 75.95,24.38 78.23,24.38 78.23,25.78 78.87,26.54 79.88,26.54 83.69,26.54 84.2,26.04 84.2,23.5 82.8,22.1 82.8,19.81 83.69,18.92 83.69,13.97 82.68,12.95 81.28,12.95 80.39,12.06 80.39,11.81 80.39,10.54 81.03,9.91 83.44,9.91 84.33,9.02 84.33,7.24 83.57,6.48 79.25,6.48 77.22,8.51 76.71,9.02 76.71,16.13 74.55,18.29
N$1
  Top 0.254: 68.77,19.24 U2.4 | Q1.3 61.26,18.88 62.1,18.03 62.1,16.89 62.87,16.13 66.93,16.13 67.56,16.76 67.55,16.78 R7.1
  Top 0.305: R7.1 67.56,17.67 67.56,18.03 68.77,19.24
N$2
  Top 0.254: U1.6 70.85,7.63
  Top 0.305: L2.P$1 68.45,10.41 69.47,9.4 C13.1 70.85,7.63
  pour Top (isolate 0.254, no thermals): 66.67,8.38 67.94,8.38 68.96,7.37 70.1,7.37 70.48,6.99 71.37,6.99 71.37,8 70.87,8.51 70.87,9.53 67.94,12.45 66.67,12.45
N$3
  Top 0.254: 74.17,6.08 R6.1
  Top 0.305: 74.17,6.08 72.96,7.3 U1.4
N$4
  Top 0.254: 74.55,4.57 R8.1
  Top 0.305: 74.55,4.57 74.1,5.02 U1.3 72.96,2.97 R9.2
N$5
  Top 0.305: R11.2 64.69,19.24 U2.3 66.62,18.47 R10.1
N$6
  Top 0.254: U2.6 69.1,21.23 | L3.P$1 71.63,23.62 70.74,22.73 C14.1
  Top 0.305: 69.1,21.23 C14.1
  pour Top (isolate 0.254, rank 6, no thermals): 68.58,21.34 68.58,20.95 69.56,20.95 70.36,21.59 71.26,21.59 73.03,23.24 73.66,23.88 73.66,25.53 70.74,25.53 68.83,23.5 68.83,21.59
N$7
  Top 0.305: C14.2 66.62,21.8 U2.1
N$8
  Top 0.305: U1.1 70.02,5.02 69.47,5.58 C13.2
N$9
  Top 0.254: J3.1 9.5,23.01 9.89,22.62 R21.2
N$10
  Top 0.254: J3.2 8.57,21.01 R22.2
N$11
  Top 0.254: J3.3 8.66,19.01 R23.2
N$12
  Top 0.254: J3.4 8.76,17.01 R24.2
N$13
  Top 0.254: J3.5 8.85,15.01 R25.2
N$14
  Top 0.254: J3.6 8.95,13.01 R26.2
N$15
  Top 0.254: J3.7 9.04,11.01 R27.2
N$16
  Top 0.254: J3.8 9.26,9.01 R28.2
N$17
  Top 0.254: U3.4 R5.2
N$18
  Top 0.254: R30.2 J5.4
N$19
  Top 0.254: U3.9 58.87,12.87 R3.1
N$20
  Top 0.305: Q1.1 58.92,16.78 R4.1
N$21
  Top 0.254: 36.83,5.59 36.82,5.6
  Top 0.305: R1.2 36.1,4.86 36.58,5.33 36.83,5.59 37.59,5.59 37.93,5.25 D1.2 | 36.82,5.6 BAT1.1
N$22
  Top 0.254: L1.2 23.23,14.1 C1.2 24.77,12.56 24.77,9.53 24.36,9.12 IC1.9
N$23
  Top 0.254: U3.7 D2.P$2
N$24
  Top 0.254: R2.2 60.47,10.57 D2.P$1
N$25
  Top 1.27: F1.2 78.61,9.02 79.5,8.13 P1.1
N$27
  Top 0.254: D4.P$2 R14.1
N$28
  Top 0.254: D3.P$2 R13.2
OSC32_IN
  Top 0.254: IC1.3 24.36,6.12 25.65,4.83 25.65,3.56 26.04,3.17 Y2.1 29.45,3.17 C4.2
OSC32_OUT
  Top 0.254: IC1.4 24.75,6.62 25.69,5.67 Y2.2 29.54,5.67 C5.2
OSC_IN
  Top 0.254: C2.2 29.45,8 Y1.1 25.91,8 25.03,7.12 IC1.5
OSC_OUT
  Top 0.254: C3.2 29.43,11.7 Y1.2 25.53,10.05 25.53,8.64 24.52,7.62 IC1.6
PWM1
  Top 0.254: R25.1 13.72,11.7 13.72,9.14 14.24,8.62 IC1.29
PWM2
  Top 0.254: R26.1 12.95,10.55 12.95,8.89 13.72,8.12 IC1.30
PWM3
  Top 0.254: R27.1 12.32,9.28 12.32,8.26 12.95,7.62 IC1.31
PWM4
  Top 0.254: R28.1 11.44,7.61 11.94,7.11 IC1.32
PWM5
  Top 0.254: R21.1 11.44,21.58 15.49,17.53 18.54,17.53 20.55,15.51 IC1.16
PWM6
  Top 0.254: IC1.17 20.05,14.72 18.03,16.74 15.01,16.74 12.06,19.68 R22.1
PWM7
  Top 0.254: R23.1 12.97,17.78 14.74,16 17.27,16 19.56,13.72 19.55,13.71 IC1.18
PWM8
  Top 0.254: IC1.19 19.05,12.95 16.76,15.24 14.36,15.24 13.73,15.88 R24.1
RST  (via drill 0.3)
  Top 0.254: R12.2 42.04,7.89 | 42.04,7.89 42.02,7.89 S1.1 | R12.2 C19.2 | R12.2 46.58,6.27 U3.16 | IC1.7 22.22,8.12 v21.72,7.62 | v39.5,9.53 40.4,9.53 42.04,7.89
  Bottom 0.254: v39.5,9.53 30.87,9.53 25.53,9.53 24.13,8.13 22.23,8.13 v21.72,7.62
RX
  Top 0.254: U3.14 47.92,8.47 49.4,6.99 53.72,6.99 54.23,7.49 54.23,15.62 J2.3
SCL  (via drill 0.3)
  Top 0.254: U3.13 46.94,9.53 v48.26,9.53 | R15.2 39.38,22.35 v40.77,22.35 41.37,22.95 J6.3 | IC1.45 20.55,4.46 v19.94,5.08
  Bottom 0.254: v48.26,9.53 45.85,9.53 40.77,14.61 v40.77,22.35 35.18,22.35 20.95,8.13 20.95,5.46 20.57,5.08 v19.94,5.08
SDA  (via drill 0.3)
  Top 0.254: J6.2 43.37,22.43 R17.2 42.05,22.36 v42.04,22.35 | U3.12 v48.26,10.67 | IC1.46 21.05,5.11 20.07,6.1 v19.94,6.1
  Bottom 0.254: v48.26,10.67 46.35,10.67 42.04,14.99 v42.04,22.35 42.04,22.99 41.66,23.37 35.05,23.37 19.94,8.26 v19.94,6.1
SW_CLK
  Top 0.254: J1.2 11.75,3.62 IC1.37
SW_DIO
  Top 0.254: J1.1 11.71,6.12 IC1.34
TEMP_DO
  Top 0.254: IC1.12 23.62,10.69 23.62,12.19 21.84,13.97 21.84,16.38 18.54,19.68 R19.2 17.41,20.56 C27.+ 15.46,22.51 J4.2
TX
  Top 0.254: U3.15 47.88,7.37 49.02,6.22 54.23,6.22 54.99,6.99 54.99,15.62 J2.4
VBAT
  Top 0.254: IC1.1 23.55,3.26 C8.1 24.37,3.19 24.64,2.92 24.64,1.78 25.15,1.27 32.54,1.27 R1.1
  Top 0.305: R1.1 34.32,3.05 D1.3
VIN  (via drill 0.61 pad 1.22)
  Top 0.254: 71.09,20.19 C12.2 | D4.P$1 79.87,24.12 79.13,23.38 79.13,20.83 C22.+ 79.52,18.81 78.61,17.91 F1.1 79.7,16.13 D5.C | 72.01,9.62 C11.2
  Top 0.305: R7.2 70.1,18.66 70.1,19.84 70.48,20.22 C12.2 72.18,21.28 C10.2 | U2.5 71.09,20.19 | C11.2 73,8.64 73.29,8.64 74.3,7.63 R6.2 | U1.5 72.01,9.62
  Top 0.61: 75.56,21.28 v75.56,22.86 | v70.87,14.1 70.87,11.99 C9.2 70.92,10.71 C11.2
  Top 1.219: C22.+ 77.22,20.45 76.71,20.95 76.38,21.28 75.56,21.28 74.93,21.28 C10.2
  Bottom 0.61: v75.56,22.86 75.56,18.8 v70.87,14.1
  pour Top (isolate 0.254, no thermals): 68.58,20.45 68.58,19.94 69.72,19.94 70.21,19.46 70.44,19.68 71.75,19.68 72.77,20.7 74.3,20.7 74.3,21.84 72.52,21.84 71.5,20.83 70.48,20.83 69.98,20.45
  pour Top (isolate 0.254, no thermals): 76.83,23.5 75.31,23.5 75.18,23.5 73.41,21.72 75.44,19.68 77.72,17.53 77.72,16.76 77.72,15.62 79.38,15.62 80.26,14.73 80.26,13.97 82.42,13.97 82.42,18.29 81.03,19.68 81.03,21.59 79.12,23.5
  pour Top (isolate 0.254, no thermals): 70.36,12.7 70.36,10.92 71.5,9.78 71.5,8.89 71.75,8.64 71.75,6.99 72.26,6.99 72.26,8.26 72.52,8.51 73.28,8.51 73.28,9.91 72.52,10.67 72.52,12.83 70.36,12.83

### Text on the board
bPlace: 24V | - | +